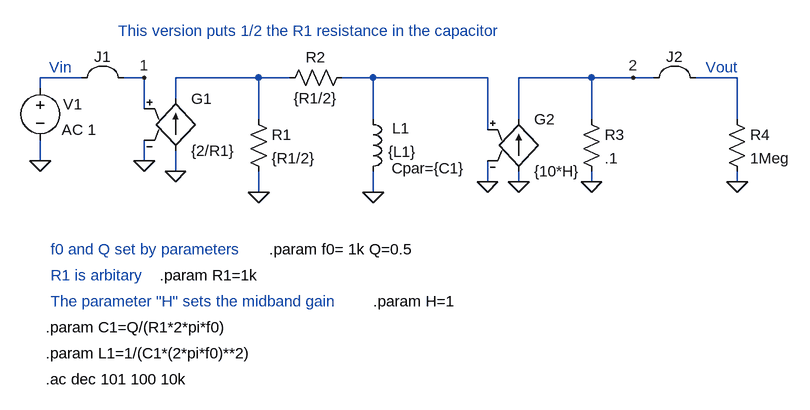
[diagram p0: schematic 2ndOrderBandpass.asc]
2ndOrderBandpass.asc, the LTspice schematic file:
Version 4
SHEET 1 1060 680
WIRE -384 -128 -448 -128
WIRE -288 -128 -320 -128
WIRE -112 -128 -240 -128
WIRE -64 -128 -112 -128
WIRE 64 -128 16 -128
WIRE 240 -128 64 -128
WIRE 400 -128 288 -128
WIRE 464 -128 400 -128
WIRE 496 -128 464 -128
WIRE 624 -128 560 -128
WIRE -448 -112 -448 -128
WIRE -240 -96 -240 -128
WIRE -288 -80 -288 -128
WIRE -112 -64 -112 -128
WIRE 64 -64 64 -128
WIRE 288 -64 288 -128
WIRE 400 -64 400 -128
WIRE 624 -64 624 -128
WIRE 240 -48 240 -128
WIRE -448 0 -448 -32
WIRE -288 0 -288 -32
WIRE -240 16 -240 -16
WIRE 240 32 240 0
WIRE 288 32 288 16
WIRE 400 32 400 16
WIRE 624 32 624 16
WIRE -112 48 -112 16
WIRE 64 48 64 16
FLAG 64 48 0
FLAG -112 48 0
FLAG -240 16 0
FLAG -288 0 0
FLAG 240 32 0
FLAG 288 32 0
FLAG 400 32 0
FLAG 464 -128 2
FLAG -288 -128 1
FLAG -448 0 0
FLAG 624 32 0
SYMBOL ind 48 -80 R0
WINDOW 0 59 45 Bottom 2
WINDOW 3 61 50 Top 2
WINDOW 123 102 107 Bottom 2
SYMATTR InstName L1
SYMATTR Value {L1}
SYMATTR Value2 Cpar={C1}
SYMBOL g -240 -112 R0
SYMATTR InstName G1
SYMATTR Value {2/R1}
SYMBOL res -128 -80 R0
SYMATTR InstName R1
SYMATTR Value {R1/2}
SYMBOL res 32 -144 R90
WINDOW 0 0 56 VBottom 2
WINDOW 3 32 56 VTop 2
SYMATTR InstName R2
SYMATTR Value {R1/2}
SYMBOL g 288 -80 R0
SYMATTR InstName G2
SYMATTR Value {10*H}
SYMBOL res 384 -80 R0
SYMATTR InstName R3
SYMATTR Value .1
SYMBOL Misc\\jumper 528 -192 R0
SYMATTR InstName J2
SYMBOL Misc\\jumper -352 -192 M0
SYMATTR InstName J1
SYMBOL voltage -448 -128 R0
WINDOW 0 35 41 Left 2
WINDOW 123 33 80 Left 2
WINDOW 39 0 0 Left 0
SYMATTR InstName V1
SYMATTR Value2 AC 1
SYMATTR Value ""
SYMBOL res 608 -80 R0
SYMATTR InstName R4
SYMATTR Value 1Meg
TEXT -96 136 Left 2 !.param f0= 1k Q=0.5
TEXT -264 176 Left 2 !.param R1=1k
TEXT -440 296 Left 2 !.param L1=1/(C1*(2*pi*f0)**2)
TEXT -432 136 Left 2 ;f0 and Q set by parameters
TEXT -432 176 Left 2 ;R1 is arbitary
TEXT -328 -200 Left 2 ;This version puts 1/2 the R1 resistance in the capacitor
TEXT -440 256 Left 2 !.param C1=Q/(R1*2*pi*f0)
TEXT 576 -144 Left 2 ;Vout
TEXT -400 -144 Right 2 ;Vin
TEXT -432 216 Left 2 ;The parameter "H" sets the midband gain
TEXT 64 216 Left 2 !.param H=1
TEXT -440 336 Left 2 !.ac dec 101 100 10k

The netlist it stands for:
* 2ndOrderBandpass.asc
L1 N002 0 {L1} Cpar={C1}
G1 0 N001 1 0 {2/R1}
R1 N001 0 {R1/2}
R2 N002 N001 {R1/2}
G2 0 2 N002 0 {10*H}
R3 2 0 .1
V1 1 0 AC 1
R4 2 0 1Meg
.param f0= 1k Q=0.5
.param R1=1k
.param L1=1/(C1*(2*pi*f0)**2)
* f0 and Q set by parameters
* R1 is arbitary
* This version puts 1/2 the R1 resistance in the capacitor
.param C1=Q/(R1*2*pi*f0)
* Vout
* Vin
* The parameter "H" sets the midband gain
.param H=1
.ac dec 101 100 10k
.backanno
.end